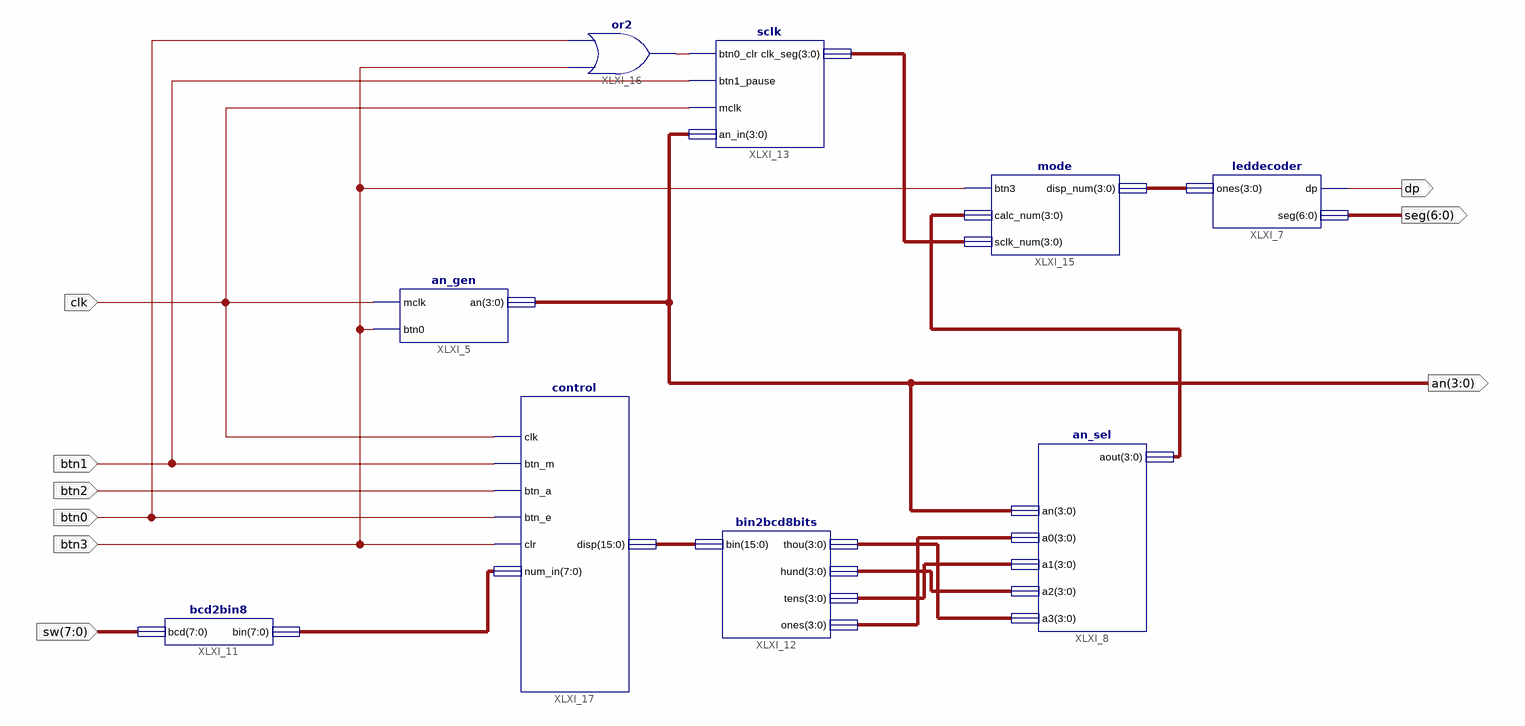
[diagram p0: schematic sheet 1]
// Xilinx ISE schematic calc.sch (spartan3e) as structural Verilog: 9 symbols, 9 ports
module calc (
  input  [7:0] sw,
  input  clk,
  input  btn1,
  input  btn2,
  input  btn0,
  input  btn3,
  output [3:0] an,
  output dp,
  output [6:0] seg
);

  wire XLXN_26;
  wire [3:0] XLXN_11, XLXN_12, XLXN_13, XLXN_15, XLXN_23, XLXN_24, XLXN_25;
  wire [7:0] XLXN_2;
  wire [15:0] XLXN_3;

  an_gen XLXI_5 (.mclk(clk), .btn0(btn3), .an(an));
  bcd2bin8 XLXI_11 (.bcd(sw), .bin(XLXN_2));
  an_sel XLXI_8 (.an(an), .a0(XLXN_15), .a1(XLXN_13), .a2(XLXN_12), .a3(XLXN_11), .aout(XLXN_24));
  bin2bcd8bits XLXI_12 (.bin(XLXN_3), .thou(XLXN_11), .hund(XLXN_12), .tens(XLXN_13), .ones(XLXN_15));
  sclk XLXI_13 (.btn0_clr(XLXN_26), .btn1_pause(btn1), .mclk(clk), .an_in(an), .clk_seg(XLXN_23));
  leddecoder XLXI_7 (.ones(XLXN_25), .dp(dp), .seg(seg));
  mode XLXI_15 (.btn3(btn3), .calc_num(XLXN_24), .sclk_num(XLXN_23), .disp_num(XLXN_25));
  or XLXI_16 (XLXN_26, btn3, btn0);
  control XLXI_17 (.clk(clk), .btn_m(btn1), .btn_a(btn2), .btn_e(btn0), .clr(btn3), .num_in(XLXN_2), .disp(XLXN_3));
endmodule
